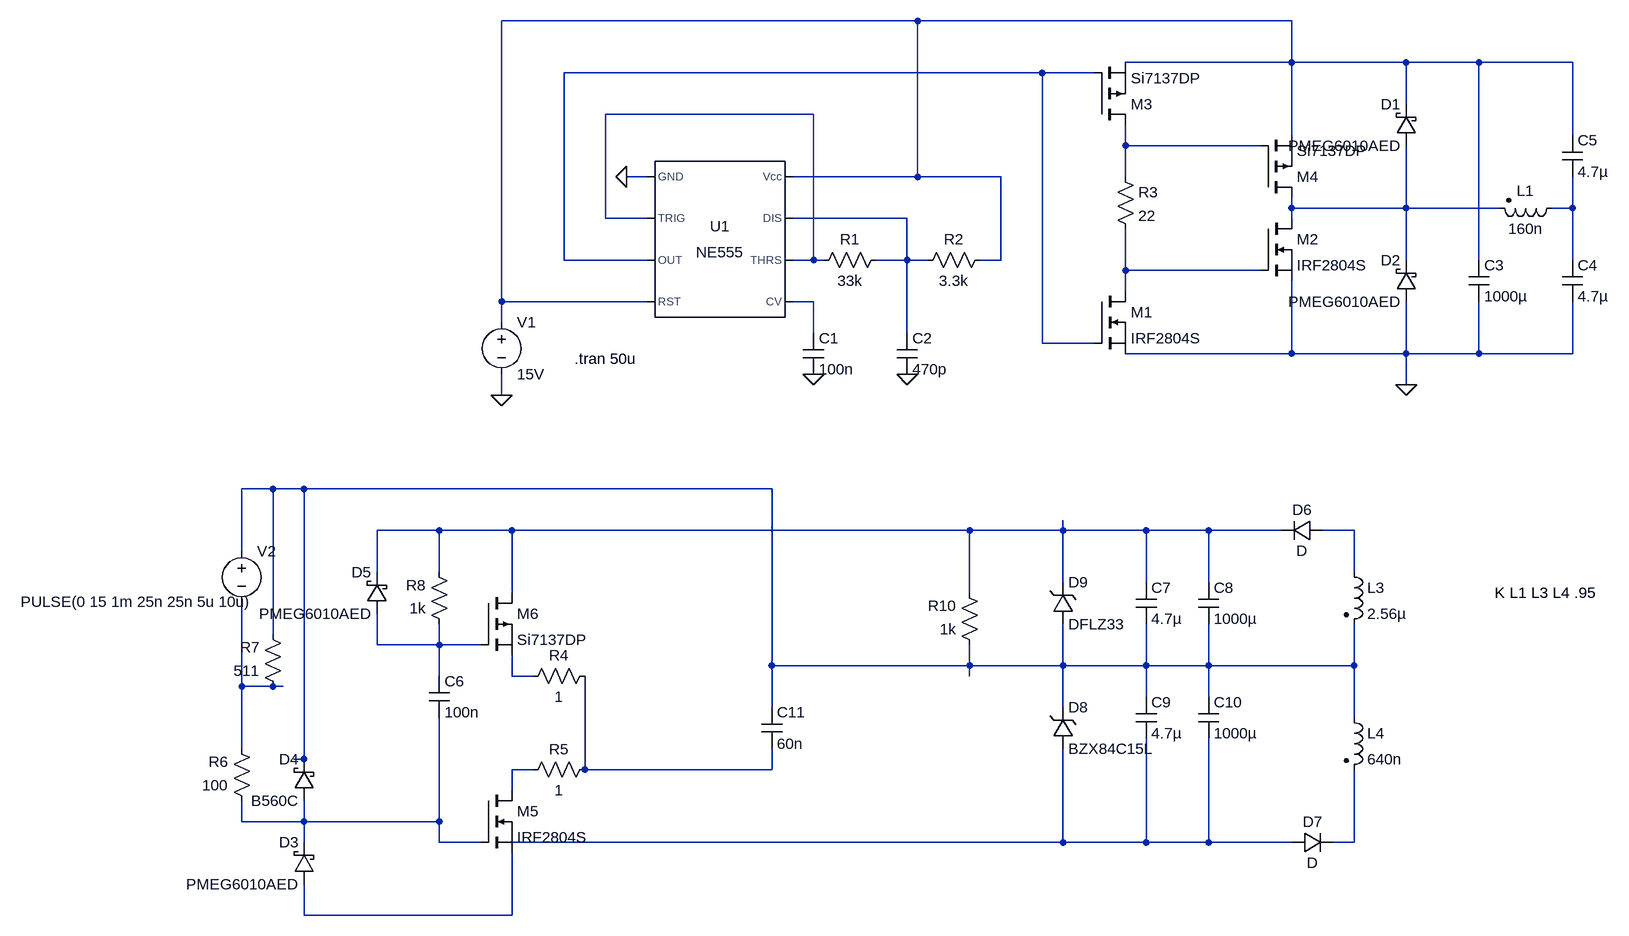
[diagram p0: schematic SMPS_chester.asc]
SMPS_chester.asc, the LTspice schematic file:
Version 4
SHEET 1 1584 1236
WIRE 464 -144 -176 -144
WIRE 1040 -144 464 -144
WIRE 1040 -80 1040 -144
WIRE 1040 -80 784 -80
WIRE 1216 -80 1040 -80
WIRE 1328 -80 1216 -80
WIRE 1472 -80 1328 -80
WIRE 656 -64 -80 -64
WIRE 736 -64 656 -64
WIRE 1216 -16 1216 -80
WIRE 304 0 -16 0
WIRE 1040 32 1040 -80
WIRE 1472 32 1472 -80
WIRE 784 48 784 16
WIRE 992 48 784 48
WIRE 48 96 16 96
WIRE 464 96 464 -144
WIRE 464 96 272 96
WIRE 592 96 464 96
WIRE 784 96 784 48
WIRE 1040 144 1040 128
WIRE 1216 144 1216 48
WIRE 1216 144 1040 144
WIRE 1360 144 1216 144
WIRE 1472 144 1472 96
WIRE 1472 144 1440 144
WIRE -16 160 -16 0
WIRE 48 160 -16 160
WIRE 448 160 272 160
WIRE 1040 160 1040 144
WIRE -80 224 -80 -64
WIRE 48 224 -80 224
WIRE 304 224 304 0
WIRE 304 224 272 224
WIRE 320 224 304 224
WIRE 448 224 448 160
WIRE 448 224 400 224
WIRE 480 224 448 224
WIRE 592 224 592 96
WIRE 592 224 560 224
WIRE 1216 224 1216 144
WIRE 1328 224 1328 -80
WIRE 1472 224 1472 144
WIRE 784 240 784 176
WIRE 992 240 784 240
WIRE 784 272 784 240
WIRE -176 288 -176 -144
WIRE 48 288 -176 288
WIRE 304 288 272 288
WIRE -176 320 -176 288
WIRE 304 336 304 288
WIRE 448 336 448 224
WIRE 656 352 656 -64
WIRE 736 352 656 352
WIRE 1040 368 1040 256
WIRE 1040 368 784 368
WIRE 1216 368 1216 288
WIRE 1216 368 1040 368
WIRE 1328 368 1328 288
WIRE 1328 368 1216 368
WIRE 1472 368 1472 288
WIRE 1472 368 1328 368
WIRE 1216 416 1216 368
WIRE -176 432 -176 400
WIRE -528 576 -576 576
WIRE -480 576 -528 576
WIRE 240 576 -480 576
WIRE -272 640 -368 640
WIRE -160 640 -272 640
WIRE 544 640 -160 640
WIRE 688 640 688 624
WIRE 688 640 544 640
WIRE 816 640 688 640
WIRE 912 640 816 640
WIRE 1024 640 912 640
WIRE 1136 640 1088 640
WIRE -576 672 -576 576
WIRE -368 704 -368 640
WIRE -272 704 -272 640
WIRE 1136 704 1136 640
WIRE 688 720 688 640
WIRE 816 720 816 640
WIRE 912 720 912 640
WIRE -160 736 -160 640
WIRE 544 736 544 640
WIRE -528 800 -528 576
WIRE -368 816 -368 768
WIRE -272 816 -272 784
WIRE -272 816 -368 816
WIRE -208 816 -272 816
WIRE 240 848 240 576
WIRE 544 848 544 816
WIRE 544 848 240 848
WIRE 688 848 688 784
WIRE 688 848 544 848
WIRE 816 848 816 784
WIRE 816 848 688 848
WIRE 912 848 912 784
WIRE 912 848 816 848
WIRE 1136 848 1136 784
WIRE 1136 848 912 848
WIRE -272 864 -272 816
WIRE -160 864 -160 832
WIRE -128 864 -160 864
WIRE 544 864 544 848
WIRE -576 880 -576 752
WIRE -528 880 -576 880
WIRE -512 880 -528 880
WIRE 816 896 816 848
WIRE 912 896 912 848
WIRE 240 912 240 848
WIRE 688 912 688 848
WIRE 1136 928 1136 848
WIRE -576 976 -576 880
WIRE -480 992 -480 576
WIRE -480 992 -496 992
WIRE -128 1008 -160 1008
WIRE -48 1008 -48 864
WIRE 240 1008 240 976
WIRE 240 1008 -48 1008
WIRE -160 1040 -160 1008
WIRE -576 1088 -576 1056
WIRE -480 1088 -480 1056
WIRE -480 1088 -576 1088
WIRE -272 1088 -272 928
WIRE -272 1088 -480 1088
WIRE -480 1120 -480 1088
WIRE -272 1120 -272 1088
WIRE -208 1120 -272 1120
WIRE 688 1120 688 976
WIRE 688 1120 -160 1120
WIRE 816 1120 816 960
WIRE 816 1120 688 1120
WIRE 912 1120 912 960
WIRE 912 1120 816 1120
WIRE 1040 1120 912 1120
WIRE 1136 1120 1136 1008
WIRE 1136 1120 1104 1120
WIRE -480 1232 -480 1184
WIRE -160 1232 -160 1136
WIRE -160 1232 -480 1232
FLAG 16 96 0
FLAG -176 432 0
FLAG 304 400 0
FLAG 448 400 0
FLAG 1216 416 0
SYMBOL Misc\\NE555 160 192 R0
SYMATTR InstName U1
SYMBOL voltage -176 304 R0
WINDOW 123 0 0 Left 2
WINDOW 39 0 0 Left 2
SYMATTR InstName V1
SYMATTR Value 15V
SYMBOL res 416 208 R90
WINDOW 0 0 56 VBottom 2
WINDOW 3 32 56 VTop 2
SYMATTR InstName R1
SYMATTR Value 33k
SYMBOL res 576 208 R90
WINDOW 0 0 56 VBottom 2
WINDOW 3 32 56 VTop 2
SYMATTR InstName R2
SYMATTR Value 3.3k
SYMBOL cap 288 336 R0
SYMATTR InstName C1
SYMATTR Value 100n
SYMBOL cap 432 336 R0
SYMATTR InstName C2
SYMATTR Value 470p
SYMBOL nmos 736 272 R0
SYMATTR InstName M1
SYMATTR Value IRF2804S
SYMBOL nmos 992 160 R0
SYMATTR InstName M2
SYMATTR Value IRF2804S
SYMBOL pmos 736 16 M180
SYMATTR InstName M3
SYMATTR Value Si7137DP
SYMBOL pmos 992 128 M180
SYMATTR InstName M4
SYMATTR Value Si7137DP
SYMBOL res 768 80 R0
SYMATTR InstName R3
SYMATTR Value 22
SYMBOL schottky 1232 48 R180
WINDOW 0 24 64 Left 2
WINDOW 3 24 0 Left 2
SYMATTR InstName D1
SYMATTR Value PMEG6010AED
SYMATTR Description Diode
SYMATTR Type diode
SYMBOL schottky 1232 288 R180
WINDOW 0 24 64 Left 2
WINDOW 3 24 0 Left 2
SYMATTR InstName D2
SYMATTR Value PMEG6010AED
SYMATTR Description Diode
SYMATTR Type diode
SYMBOL cap 1312 224 R0
SYMATTR InstName C3
SYMATTR Value 1000µ
SYMBOL ind2 1456 128 R90
WINDOW 0 5 56 VBottom 2
WINDOW 3 32 56 VTop 2
SYMATTR InstName L1
SYMATTR Value 160n
SYMATTR Type ind
SYMATTR SpiceLine Rser=1.5m
SYMBOL cap 1456 224 R0
SYMATTR InstName C4
SYMATTR Value 4.7µ
SYMBOL cap 1456 32 R0
SYMATTR InstName C5
SYMATTR Value 4.7µ
SYMBOL nmos -208 1040 R0
SYMATTR InstName M5
SYMATTR Value IRF2804S
SYMBOL pmos -208 736 R0
SYMATTR InstName M6
SYMATTR Value Si7137DP
SYMBOL res -32 848 R90
WINDOW 0 0 56 VBottom 2
WINDOW 3 32 56 VTop 2
SYMATTR InstName R4
SYMATTR Value 1
SYMBOL res -32 992 R90
WINDOW 0 0 56 VBottom 2
WINDOW 3 32 56 VTop 2
SYMATTR InstName R5
SYMATTR Value 1
SYMBOL res -560 1072 R180
WINDOW 0 36 76 Left 2
WINDOW 3 36 40 Left 2
SYMATTR InstName R6
SYMATTR Value 100
SYMBOL res -512 896 R180
WINDOW 0 36 76 Left 2
WINDOW 3 36 40 Left 2
SYMATTR InstName R7
SYMATTR Value 511
SYMBOL res -256 800 R180
WINDOW 0 36 76 Left 2
WINDOW 3 36 40 Left 2
SYMATTR InstName R8
SYMATTR Value 1k
SYMBOL res 560 832 R180
WINDOW 0 36 76 Left 2
WINDOW 3 36 40 Left 2
SYMATTR InstName R10
SYMATTR Value 1k
SYMBOL cap -288 864 R0
SYMATTR InstName C6
SYMATTR Value 100n
SYMBOL cap 800 720 R0
SYMATTR InstName C7
SYMATTR Value 4.7µ
SYMBOL cap 896 720 R0
SYMATTR InstName C8
SYMATTR Value 1000µ
SYMBOL cap 800 896 R0
SYMATTR InstName C9
SYMATTR Value 4.7µ
SYMBOL cap 896 896 R0
SYMATTR InstName C10
SYMATTR Value 1000µ
SYMBOL schottky -464 1184 R180
WINDOW 0 24 64 Left 2
WINDOW 3 24 0 Left 2
SYMATTR InstName D3
SYMATTR Value PMEG6010AED
SYMATTR Description Diode
SYMATTR Type diode
SYMBOL schottky -464 1056 R180
WINDOW 0 24 64 Left 2
WINDOW 3 24 0 Left 2
SYMATTR InstName D4
SYMATTR Value B560C
SYMATTR Description Diode
SYMATTR Type diode
SYMBOL schottky -352 768 R180
WINDOW 0 24 64 Left 2
WINDOW 3 24 0 Left 2
SYMATTR InstName D5
SYMATTR Value PMEG6010AED
SYMATTR Description Diode
SYMATTR Type diode
SYMBOL diode 1088 656 M270
WINDOW 0 32 32 VTop 2
WINDOW 3 0 32 VBottom 2
SYMATTR InstName D6
SYMBOL diode 1040 1136 R270
WINDOW 0 32 32 VTop 2
WINDOW 3 0 32 VBottom 2
SYMATTR InstName D7
SYMBOL zener 672 976 M180
WINDOW 0 24 64 Left 2
WINDOW 3 24 0 Left 2
SYMATTR InstName D8
SYMATTR Value BZX84C15L
SYMATTR Description Diode
SYMATTR Type diode
SYMBOL zener 672 784 M180
WINDOW 0 24 64 Left 2
WINDOW 3 24 0 Left 2
SYMATTR InstName D9
SYMATTR Value DFLZ33
SYMATTR Description Diode
SYMATTR Type diode
SYMBOL ind2 1120 688 R0
SYMATTR InstName L3
SYMATTR Value 2.56µ
SYMATTR Type ind
SYMATTR SpiceLine Ipk=5m
SYMBOL ind2 1120 912 R0
SYMATTR InstName L4
SYMATTR Value 640n
SYMATTR Type ind
SYMATTR SpiceLine Rser=5m
SYMBOL cap 224 912 R0
SYMATTR InstName C11
SYMATTR Value 60n
SYMBOL voltage -576 656 R0
WINDOW 3 -340 94 Left 2
WINDOW 123 0 0 Left 2
WINDOW 39 0 0 Left 2
SYMATTR Value PULSE(0 15 1m 25n 25n 5u 10u)
SYMATTR InstName V2
TEXT -64 376 Left 2 !.tran 50u
TEXT 1352 736 Left 2 !K L1 L3 L4 .95

The netlist it stands for:
* SMPS_chester.asc
XU1 0 N003 N002 N001 N009 N003 N007 N001 NE555  ; pins GND TRIG OUT RST CV THRS DIS Vcc
V1 N001 0 15V
R1 N007 N003 33k
R2 N001 N007 3.3k
C1 N009 0 100n
C2 N007 0 470p
M1 N008 N002 0 0 IRF2804S
M2 N005 N008 0 0 IRF2804S
M3 N004 N002 N001 N001 Si7137DP
M4 N005 N004 N001 N001 Si7137DP
R3 N004 N008 22
D1 N005 N001 PMEG6010AED
D2 0 N005 PMEG6010AED
C3 N001 0 1000µ
L1 N006 N005 160n Rser=1.5m
C4 N006 0 4.7µ
C5 N001 N006 4.7µ
M5 N016 N018 N021 N021 IRF2804S
M6 N011 N013 N014 N014 Si7137DP
R4 N017 N014 1
R5 N017 N016 1
R6 N018 N015 100
R7 N015 N010 511
R8 N013 N011 1k
R10 N010 N011 1k
C6 N013 N018 100n
C7 N011 N010 4.7µ
C8 N011 N010 1000µ
C9 N010 N019 4.7µ
C10 N010 N019 1000µ
D3 N021 N018 PMEG6010AED
D4 N018 N010 B560C
D5 N013 N011 PMEG6010AED
D6 N012 N011 D
D7 N019 N020 D
D8 N019 N010 BZX84C15L
D9 N010 N011 DFLZ33
L3 N012 N010 2.56µ Ipk=5m
L4 N010 N020 640n Rser=5m
C11 N010 N017 60n
V2 N010 N015 PULSE(0 15 1m 25n 25n 5u 10u)
.model D D
.lib standard.dio
.model NMOS NMOS
.model PMOS PMOS
.lib standard.mos
.tran 50u
K L1 L3 L4 .95
.lib NE555.sub
.backanno
.end